# Altium schematic sheet MainBoard.SchDoc
size A4
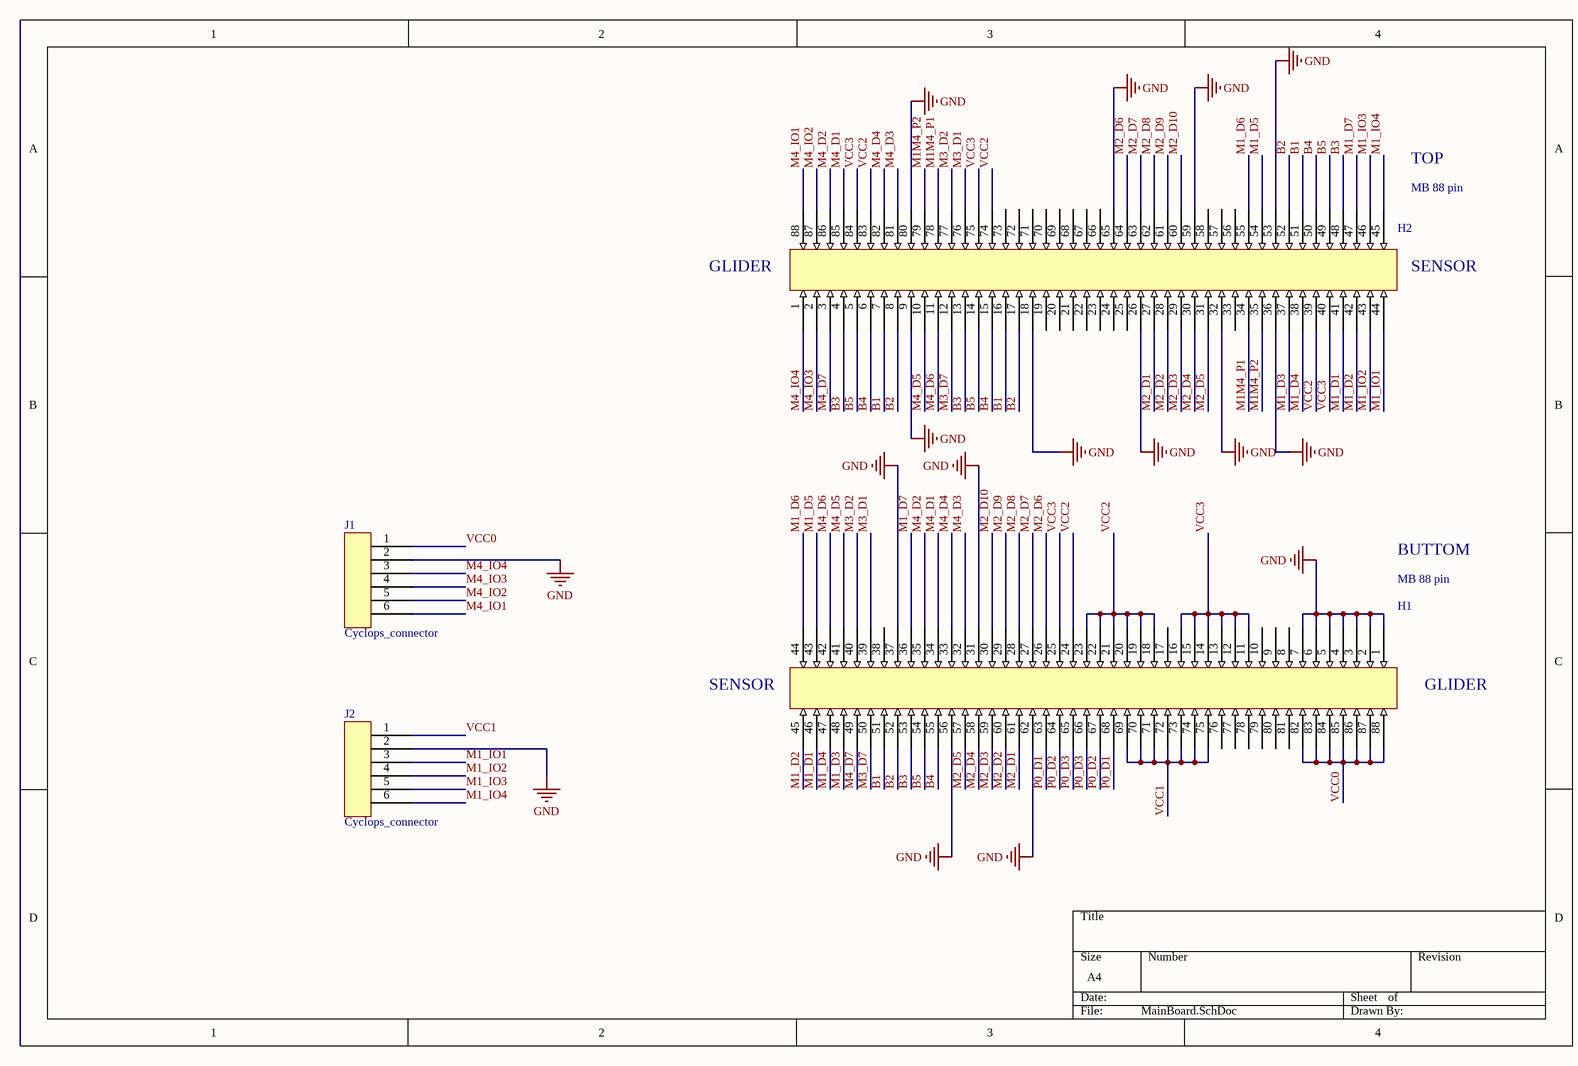
[diagram p0: MainBoard.SchDoc]

## Parts
H1  MB 88 pin  [MB 88 pins]
H2  MB 88 pin  [MB 88 pins]
J1  Cyclops_connector  [CYCLOPS-1LINE]
J2  Cyclops_connector  [CYCLOPS-1LINE]

## Nets
GND: H1.1 H1.2 H1.3 H1.4 H1.5 H1.6 H1.7 H1.31 H1.37 H1.56 H1.62 H2.9 H2.18 H2.26 H2.32 H2.36 H2.53 H2.59 H2.65 H2.80 J1.2 J2.2
B1: H1.51 H2.7 H2.16 H2.51
B2: H1.52 H2.8 H2.17 H2.52
B3: H1.53 H2.4 H2.13 H2.48
B4: H1.55 H2.6 H2.15 H2.50
B5: H1.54 H2.5 H2.14 H2.49
M1_D1: H1.46 H2.41
M1_D2: H1.45 H2.42
M1_D3: H1.48 H2.37
M1_D4: H1.47 H2.38
M1_D5: H1.43 H2.54
M1_D6: H1.44 H2.55
M1_D7: H1.36 H2.47
M1_IO1: H2.44 J2.3
M1_IO2: H2.43 J2.4
M1_IO3: H2.46 J2.5
M1_IO4: H2.45 J2.6
M1M4_P1: H2.34 H2.78
M1M4_P2: H2.35 H2.79
M2_D1: H1.61 H2.27
M2_D2: H1.60 H2.28
M2_D3: H1.59 H2.29
M2_D4: H1.58 H2.30
M2_D5: H1.57 H2.31
M2_D6: H1.26 H2.64
M2_D7: H1.27 H2.63
M2_D8: H1.28 H2.62
M2_D9: H1.29 H2.61
M2_D10: H1.30 H2.60
M3_D1: H1.39 H2.76
M3_D2: H1.40 H2.77
M3_D7: H1.50 H2.12
M4_D1: H1.34 H2.85
M4_D2: H1.35 H2.86
M4_D3: H1.32 H2.81
M4_D4: H1.33 H2.82
M4_D5: H1.41 H2.10
M4_D6: H1.42 H2.11
M4_D7: H1.49 H2.3
M4_IO1: H2.88 J1.6
M4_IO2: H2.87 J1.5
M4_IO3: H2.2 J1.4
M4_IO4: H2.1 J1.3
P0_D1: H1.63 H1.68
P0_D2: H1.64 H1.67
P0_D3: H1.65 H1.66
VCC0: H1.82 H1.83 H1.84 H1.85 H1.86 H1.87 H1.88 J1.1
VCC1: H1.69 H1.70 H1.71 H1.72 H1.73 H1.74 H1.75 J2.1
VCC2: H1.18 H1.19 H1.20 H1.21 H1.22 H1.23 H1.24 H2.39 H2.74 H2.83
VCC3: H1.11 H1.12 H1.13 H1.14 H1.15 H1.16 H1.25 H2.40 H2.75 H2.84

Not connected (* = marked no-connect by the designer): H1 8 9 10 17 38 76 77 78 79 80 81; H2 19 20 21 22 23 24 25 33 56 57 58 66 67 68 69 70 71 72 73

## Notes on the sheet
- TOP
- (near H2) GLIDER
- (near H2) SENSOR
- BUTTOM
- (near H1) SENSOR
- (near H1) GLIDER